# Altium project Groot.PrjPcb
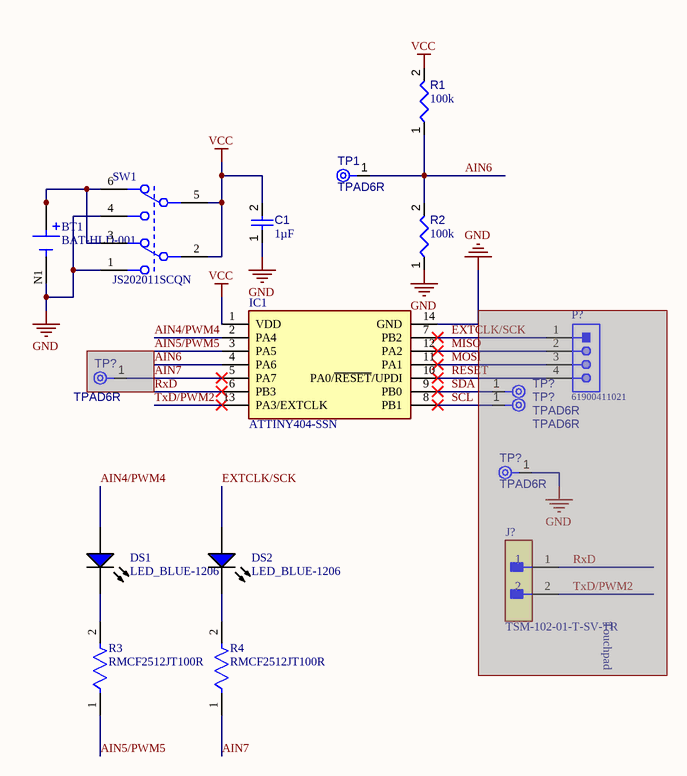
[diagram p0: Sheet1.SchDoc]
CAGE_CODE: ?????; CONTRACT_NUMBER: <CONTRACT NO>; DOC_NO_ASSY_DWG: <ASSY DWG NO>; DOC_NO_BOM: <BOM DOC NO>; DOC_NO_FAB_DWG: <FAB DWG NO>; DOC_NO_SCH_DWG: <SCH DWG NO>; PCB_2_DEC_TOL: +/-.01; PCB_3_DEC_TOL: +/-.010; PCB_ANG_TOL: +/-1/2; PCB_ASSEMBLY_NO: <PCB ASSY NO>; PCB_CHECKER: - -----; PCB_CHECKER_APP_DATE: --/--/----; PCB_DESIGNER: - -----; PCB_DESIGNER_APP_DATE: --/--/----; PCB_DWG_NO: <PCB DWG NO>; PCB_ENGINEER: - -----; PCB_ENGINEER_APP_DATE: --/--/----; PCB_PART_NUMBER: <PCB PN>; PCB_REV: A; SCH_REV: A
1 sheet, 17 parts. Net scope: global (net labels, ports and power ports of the same name join across sheets).
Board files: PCBRART.PcbDoc, PCB1.PcbDoc

## Sheet Sheet1.SchDoc
size A4; SheetNumber: 1; SheetTotal: 1

### Parts
(Parts that share a designator on the sheet are numbered #1, #2 ... from top to bottom, then left to right.)
BT1  BAT-HLD-001  [BAT_BAT-HLD-001]
C1  value 1µF  [CAPC3216X180X20ML20]  (hidden comment: Capacitor 1 uF +/- 10% 25 V 1206)
DS1  LED_BLUE-1206  [LEDC3418X06M]
DS2  LED_BLUE-1206  [LEDC3418X06M]
IC1  ATTINY404-SSN  [SOIC127P600X175-14N]
J?  TSM-102-01-T-SV-TR  [FP-TSM-102-01-T-SV-TR-MFG]  (masked out: inside a compile mask, not in the netlist)
P?  61900411021  [61900411021]  (masked out: inside a compile mask, not in the netlist)
R1  value 100k  [RESC3216X60X45ML15T20]  (hidden comment: Resistor 100k +/-1% 1206 250 mW)
R2  value 100k  [RESC3216X60X45ML15T20]  (hidden comment: Resistor 100k +/-1% 1206 250 mW)
R3  RMCF2512JT100R  [FP-RMCF2512-MFG]
R4  RMCF2512JT100R  [FP-RMCF2512-MFG]
SW1  JS202011SCQN  [FP-JS202011SCQN-MFG]
TP1  TPAD6R  [TP06R]  (no BOM)
TP?#1  TPAD6R  [TP06R]  (no BOM)  (masked out: inside a compile mask, not in the netlist)
TP?#2  TPAD6R  [TP06R]  (no BOM)  (masked out: inside a compile mask, not in the netlist)
TP?#3  TPAD6R  [TP06R]  (no BOM)  (masked out: inside a compile mask, not in the netlist)
TP?#4  TPAD6R  [TP06R]  (no BOM)  (masked out: inside a compile mask, not in the netlist)

### Nets
GND: BT1.N1(NEG) C1.1 IC1.14(GND) R2.1 SW1.1 SW1.4
VCC: C1.2 IC1.1(VDD) R1.2 SW1.2 SW1.5
AIN4/PWM4: DS1.1(A) IC1.2(PA4)
AIN5/PWM5: R3.1
AIN6: R1.1 R2.2 TP1.1(TP)
AIN7: R4.1
EXTCLK/SCK: DS2.1(A) IC1.7(PB2)
MISO: IC1.12(PA2)
MOSI: IC1.11(PA1)
RESET: IC1.10(PA0/~{RESET}/UPDI)
SCL: IC1.8(PB1)
SDA: IC1.9(PB0)
TxD/PWM2: IC1.13(PA3/EXTCLK)
NetBT1_P1: BT1.P1(POS) BT1.P2(POS) SW1.3 SW1.6
NetDS1_2: DS1.2(K) R3.2
NetDS2_2: DS2.2(K) R4.2

Not connected (* = marked no-connect by the designer): IC1 3(PA5) 4(PA6) 5(PA7)* 6(PB3)*

### Notes on the sheet
- Touchpad

### Library data of the parts
BT1 = BAT-HLD-001: Battery Retainer Coin, 20.0mm 1 Cell SMD (SMT) Tab; MF: {'manufacturer': u'Linx'}; Availability: Unavailable; Price: None; MP: BAT-HLD-001; Package: None; Value: *
C1 = CMP-001-00006-5: Chip Capacitor, 1 uF, +/- 10%, 25 V, 1206 (3216 Metric); Capacitor Type: Ceramic; Voltage Rating: 25V; Max Operating Temperature: 125°C; Pins: 2; Mounting Technology: SM; RoHS Compliant: True; Min Operating Temperature: -55°C; Case/Package: 1206; Tolerance: 10%
DS1 DS2 = CMP-007-00036-1: Generic LED in 1206 package
IC1 = ATTINY404-SSN: Integrated Circuit; Manufacturer_Name: Microchip; Datasheet Link: https://componentsearchengine.com/Datasheets/2/ATTINY404-SSN.pdf; Height: 1.75mm; Manufacturer_Part_Number: ATTINY404-SSN; Mouser Part Number: 579-ATTINY404-SSN; Mouser Price/Stock: https://www.mouser.co.uk/ProductDetail/Microchip-Technology/ATTINY404-SSN?qs=3HJ2avRr9PJ8OrTjUlXZkg%3D%3D; Arrow Part Number: ATTINY404-SSN; Arrow Price/Stock: https://www.arrow.com/en/products/attiny404-ssn/microchip-technology?region=nac
J? = CMP-02766-000113-1: CONN HEADER SMD 2POS 2.54MM; Gender: Male; Max Voltage Rating (AC): 475V; Number of Contacts: 2; Max Current Rating: 7A; Contact Material: Bronze; Min Operating Temperature: -55°C; REACH SVHC: No SVHC; Housing Material: Polymer; Lead Free: Lead Free; Orientation: Straight; Radiation Hardening: No; Number of Rows: 1; Length: 5.08mm; Housing Color: Black; Max Operating Temperature: 105°C; Contact Plating: Tin; Depth: 2.54mm; Packaging: Tape and Reel; Pitch: 2.54mm; Termination: Solder
P? = CMP-1502-00594-1: Male Bottom Locking Header WR-WTB, THT, Right Angled, pitch 2.54 mm, 1 x 4 position; Manufacturer: Wurth Elektronik; Position: 1x4; Working Voltage: 250VAC; Pitch: 2.54mm; Contact Resistance: 20mOhm; Part Number: 61900411021; Operating Temperature: -40to105degC; Orientation: RightAngled; Packaging: Bag; Datasheet URL: https://katalog.we-online.de/em/datasheet/6190xx11021.pdf; Package Reference: 61900411021; Publisher: WurthElektronik; Mounting Technology: THT; Manufacturer URL: http://www.we-online.de; Gender: Male
R1 R2 = CMP-009-00025-4: Chip Resistor, 100 KOhm, +/- 1%, 0.25 W, -55 to 155 degC, 1206 (3216 Metric); Voltage Rating: 200V; Power: 250mW; Mounting Technology: SM; Pins: 2; Min Operating Temperature: -55°C; Max Operating Temperature: 155°C; Tolerance: 1%; RoHS Compliant: True; Case/Package: 1206
R3 R4 = CMP-26527-003850-1: 100Ω ±5% 1W 2512 Thick Film Chip Resistor AEC-Q200 compliant; Temperature Coefficient: 200ppm/°C; Resistance: 100R; Construction: Rectangular; Resistor Type: Thick Film; Depth: 1.25mm; Case/Package: 2512; RoHS Compliant: Yes; Case Code (Imperial): 2512; Mount: Surface Mount; Packaging: Tape and Reel; Max Power Dissipation: 1W; Size Code: 2512; Power Rating: 1W; Length: 0.248inch; Series: RMCF; Radiation Hardening: No; Lead Free: Lead Free; Min Operating Temperature: -55°C; Width: 0.126inch; Features: Automotive AEC-Q200; Military Standard: Not; Height: 0.028inch; Max Operating Temperature: 155°C; Case Code (Metric): 6432; Tolerance: 5%; Contact Plating: Tin; Number of Terminations: 2
SW1 = CMP-2000-05087-3: SWITCH SLIDE DPDT 300MA 6V; Switch Function: On-On; Actuator Type: Standard; Switch Travel: 2mm; Actuator Color: Black; Contact Resistance: 70mR; Electrical Life: 5000Cycles; Actuator Material: Nylon; REACH SVHC: No SVHC; Series: JS; Min Operating Temperature: -20°C; Depth: 7.5mm; Housing Material: Nylon; Voltage Rating (DC): 6V; Max Operating Temperature: 85°C; Contact Current Rating: 300mA; Package Quantity: 1; Contact Plating: Silver; Contact Material: Copper Alloy; Throw Configuration: DPDT; Current Rating: 300mA; Orientation: Vertical; Max Current Rating: 300mA; Max Voltage Rating (DC): 6V; Flammability Rating: UL94 V-2; Length: 9mm; Packaging: Tape and Reel; Mount: Surface Mount; Actuator Length: 2mm; Lead Free: Lead Free; Termination: Gull Wing; Radiation Hardening: No
TP1 = CMP-00028-00002-1: Touchpad; Pins: 1
TP?#1-TP?#4 = CMP-00028-00002-1: 0.6mm round; Pins: 1